# Altium schematic sheet BLOCK4.SchDoc
size A3; SheetNumber: 4; SheetTotal: 12
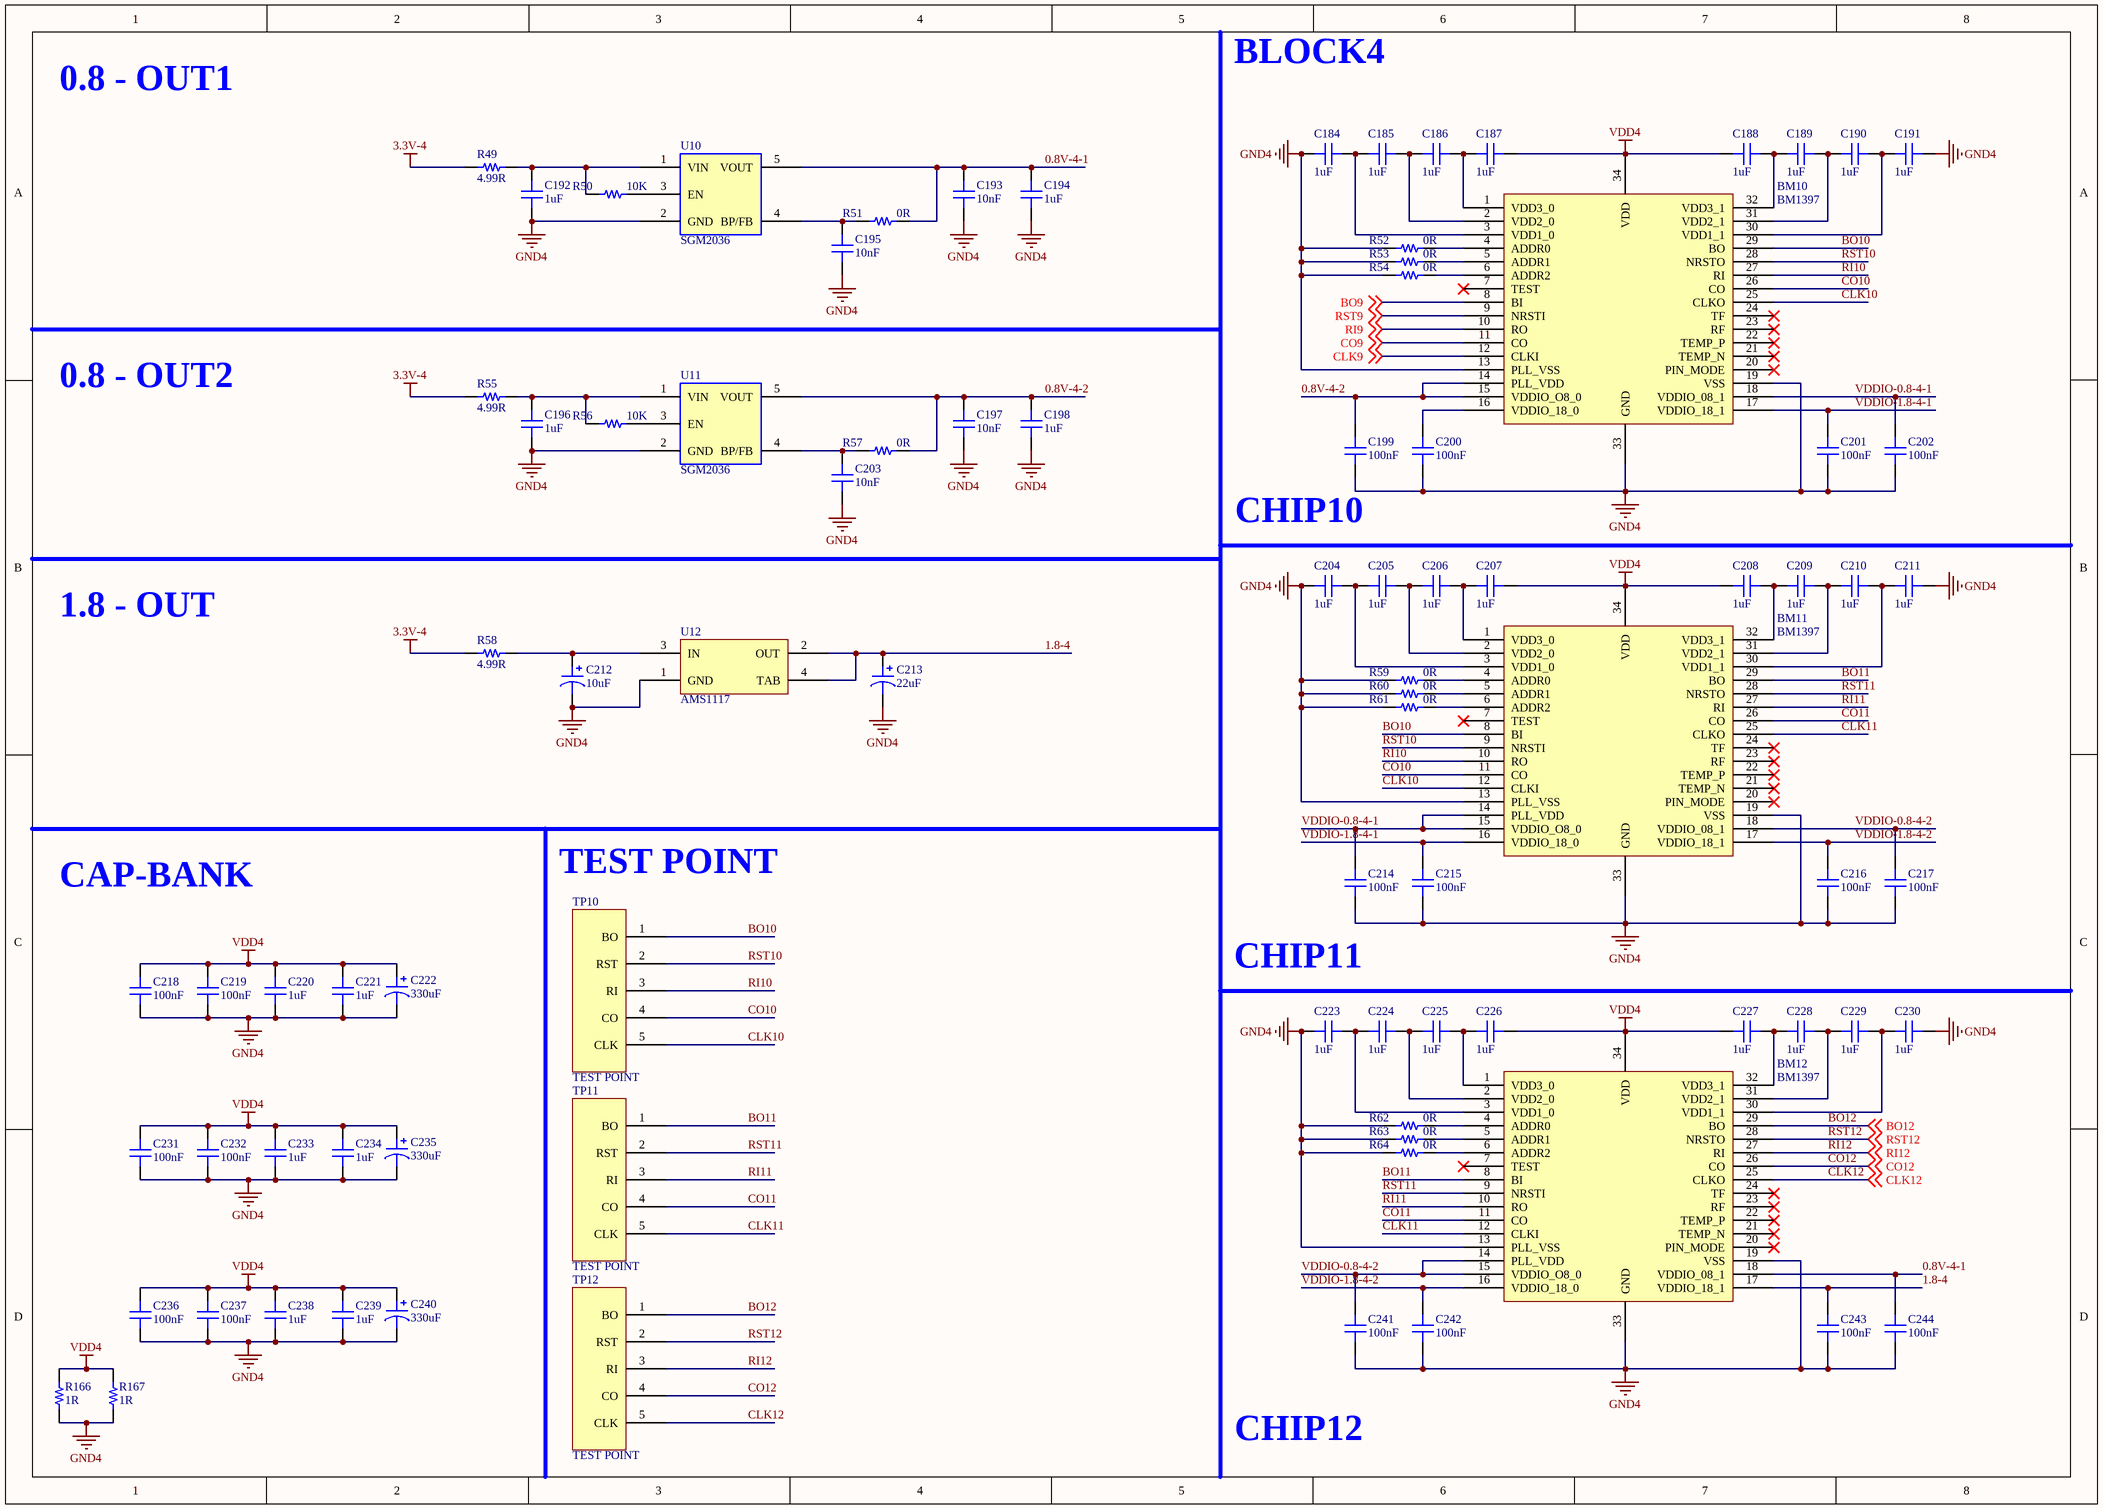
[diagram p0: BLOCK4.SchDoc]

## Parts
BM10  BM1397  [BM1387]
BM11  BM1397  [BM1387]
BM12  BM1397  [BM1387]
C184  1uF  [CAP-SMD-0603]
C185  1uF  [CAP-SMD-0603]
C186  1uF  [CAP-SMD-0603]
C187  1uF  [CAP-SMD-0603]
C188  1uF  [CAP-SMD-0603]
C189  1uF  [CAP-SMD-0603]
C190  1uF  [CAP-SMD-0603]
C191  1uF  [CAP-SMD-0603]
C192  1uF  [CAP_SMD_0805]
C193  10nF  [CAP_SMD_0805]
C194  1uF  [CAP_SMD_0805]
C195  10nF  [CAP_SMD_0805]
C196  1uF  [CAP_SMD_0805]
C197  10nF  [CAP_SMD_0805]
C198  1uF  [CAP_SMD_0805]
C199  100nF  [CAP_SMD_0805]
C200  100nF  [CAP_SMD_0805]
C201  100nF  [CAP_SMD_0805]
C202  100nF  [CAP_SMD_0805]
C203  10nF  [CAP_SMD_0805]
C204  1uF  [CAP-SMD-0603]
C205  1uF  [CAP-SMD-0603]
C206  1uF  [CAP-SMD-0603]
C207  1uF  [CAP-SMD-0603]
C208  1uF  [CAP-SMD-0603]
C209  1uF  [CAP-SMD-0603]
C210  1uF  [CAP-SMD-0603]
C211  1uF  [CAP-SMD-0603]
C212  10uF  [CAP-TAN-CASE-A]
C213  22uF  [CAP-TAN-CASE-A]
C214  100nF  [CAP_SMD_0805]
C215  100nF  [CAP_SMD_0805]
C216  100nF  [CAP_SMD_0805]
C217  100nF  [CAP_SMD_0805]
C218  100nF  [CAP_SMD_0805]
C219  100nF  [CAP_SMD_0805]
C220  1uF  [CAP_SMD_0805]
C221  1uF  [CAP_SMD_0805]
C222  330uF  [CAP-TAN-CASE-E]
C223  1uF  [CAP-SMD-0603]
C224  1uF  [CAP-SMD-0603]
C225  1uF  [CAP-SMD-0603]
C226  1uF  [CAP-SMD-0603]
C227  1uF  [CAP-SMD-0603]
C228  1uF  [CAP-SMD-0603]
C229  1uF  [CAP-SMD-0603]
C230  1uF  [CAP-SMD-0603]
C231  100nF  [CAP_SMD_0805]
C232  100nF  [CAP_SMD_0805]
C233  1uF  [CAP_SMD_0805]
C234  1uF  [CAP_SMD_0805]
C235  330uF  [CAP-TAN-CASE-E]
C236  100nF  [CAP_SMD_0805]
C237  100nF  [CAP_SMD_0805]
C238  1uF  [CAP_SMD_0805]
C239  1uF  [CAP_SMD_0805]
C240  330uF  [CAP-TAN-CASE-E]
C241  100nF  [CAP_SMD_0805]
C242  100nF  [CAP_SMD_0805]
C243  100nF  [CAP_SMD_0805]
C244  100nF  [CAP_SMD_0805]
R49  4.99R  [RES-SMD-1206]
R50  10K  [RES-SMD-0402]
R51  0R  [RES-SMD-0402]
R52  0R  [RES-SMD-0402]
R53  0R  [RES-SMD-0402]
R54  0R  [RES-SMD-0402]
R55  4.99R  [RES-SMD-1206]
R56  10K  [RES-SMD-0402]
R57  0R  [RES-SMD-0402]
R58  4.99R  [RES-SMD-1206]
R59  0R  [RES-SMD-0402]
R60  0R  [RES-SMD-0402]
R61  0R  [RES-SMD-0402]
R62  0R  [RES-SMD-0402]
R63  0R  [RES-SMD-0402]
R64  0R  [RES-SMD-0402]
R166  1R  [RES-SMD-1210]
R167  1R  [RES-SMD-1210]
TP10  TEST POINT  [TEST_POINT]
TP11  TEST POINT  [TEST_POINT]
TP12  TEST POINT  [TEST_POINT]
U10  SGM2036  [SOT23-5PIN]
U11  SGM2036  [SOT23-5PIN]
U12  AMS1117  [AMS1117]

## Nets
3.3V-4: R49.1 R55.1 R58.1
GND4: BM10.13(PLL_VSS) BM10.19(VSS) BM10.33(GND) BM11.13(PLL_VSS) BM11.19(VSS) BM11.33(GND) BM12.13(PLL_VSS) BM12.19(VSS) BM12.33(GND) C184.1 C191.2 C192.1 C193.1 C194.1 C195.1 C196.1 C197.1 C198.1 C199.1 C200.1 C201.1 C202.1 C203.1 C204.1 C211.2 C212.2 C213.2 C214.1 C215.1 C216.1 C217.1 C218.1 C219.1 C220.1 C221.1 C222.2 C223.1 C230.2 C231.1 C232.1 C233.1 C234.1 C235.2 C236.1 C237.1 C238.1 C239.1 C240.2 C241.1 C242.1 C243.1 C244.1 R52.1 R53.1 R54.1 R59.1 R60.1 R61.1 R62.1 R63.1 R64.1 R166.1 R167.1 U10.2(GND) U11.2(GND) U12.1(GND)
VDD4: BM10.34(VDD) BM11.34(VDD) BM12.34(VDD) C187.2 C188.1 C207.2 C208.1 C218.2 C219.2 C220.2 C221.2 C222.1 C226.2 C227.1 C231.2 C232.2 C233.2 C234.2 C235.1 C236.2 C237.2 C238.2 C239.2 C240.1 R166.2 R167.2
0.8V-4-1: BM12.18(VDDIO_08_1) C193.2 C194.2 C244.2 R51.2 U10.5(VOUT)
0.8V-4-2: BM10.14(PLL_VDD) BM10.15(VDDIO_O8_0) C197.2 C198.2 C199.2 R57.2 U11.5(VOUT)
1.8-4: BM12.17(VDDIO_18_1) C213.1 C243.2 U12.2(OUT) U12.4(TAB)
BO9: BM10.8(BI) ; off-sheet BO9
BO10: BM10.29(BO) BM11.8(BI) TP10.1(BO)
BO11: BM11.29(BO) BM12.8(BI) TP11.1(BO)
BO12: BM12.29(BO) TP12.1(BO) ; off-sheet BO12
CLK9: BM10.12(CLKI) ; off-sheet CLK9
CLK10: BM10.25(CLKO) BM11.12(CLKI) TP10.5(CLK)
CLK11: BM11.25(CLKO) BM12.12(CLKI) TP11.5(CLK)
CLK12: BM12.25(CLKO) TP12.5(CLK) ; off-sheet CLK12
CO9: BM10.11(CO) ; off-sheet CO9
CO10: BM10.26(CO) BM11.11(CO) TP10.4(CO)
CO11: BM11.26(CO) BM12.11(CO) TP11.4(CO)
CO12: BM12.26(CO) TP12.4(CO) ; off-sheet CO12
RI9: BM10.10(RO) ; off-sheet RI9
RI10: BM10.27(RI) BM11.10(RO) TP10.3(RI)
RI11: BM11.27(RI) BM12.10(RO) TP11.3(RI)
RI12: BM12.27(RI) TP12.3(RI) ; off-sheet RI12
RST9: BM10.9(NRSTI) ; off-sheet RST9
RST10: BM10.28(NRSTO) BM11.9(NRSTI) TP10.2(RST)
RST11: BM11.28(NRSTO) BM12.9(NRSTI) TP11.2(RST)
RST12: BM12.28(NRSTO) TP12.2(RST) ; off-sheet RST12
VDDIO-0.8-4-1: BM10.18(VDDIO_08_1) BM11.14(PLL_VDD) BM11.15(VDDIO_O8_0) C202.2 C214.2
VDDIO-0.8-4-2: BM11.18(VDDIO_08_1) BM12.14(PLL_VDD) BM12.15(VDDIO_O8_0) C217.2 C241.2
VDDIO-1.8-4-1: BM10.17(VDDIO_18_1) BM11.16(VDDIO_18_0) C201.2 C215.2
VDDIO-1.8-4-2: BM11.17(VDDIO_18_1) BM12.16(VDDIO_18_0) C216.2 C242.2
NetBM10_1: BM10.1(VDD3_0) C186.2 C187.1
NetBM10_2: BM10.2(VDD2_0) C185.2 C186.1
NetBM10_3: BM10.3(VDD1_0) C184.2 C185.1
NetBM10_4: BM10.4(ADDR0) R52.2
NetBM10_5: BM10.5(ADDR1) R53.2
NetBM10_6: BM10.6(ADDR2) R54.2
NetBM10_16: BM10.16(VDDIO_18_0) C200.2
NetBM10_30: BM10.30(VDD1_1) C190.2 C191.1
NetBM10_31: BM10.31(VDD2_1) C189.2 C190.1
NetBM10_32: BM10.32(VDD3_1) C188.2 C189.1
NetBM11_1: BM11.1(VDD3_0) C206.2 C207.1
NetBM11_2: BM11.2(VDD2_0) C205.2 C206.1
NetBM11_3: BM11.3(VDD1_0) C204.2 C205.1
NetBM11_4: BM11.4(ADDR0) R59.2
NetBM11_5: BM11.5(ADDR1) R60.2
NetBM11_6: BM11.6(ADDR2) R61.2
NetBM11_30: BM11.30(VDD1_1) C210.2 C211.1
NetBM11_31: BM11.31(VDD2_1) C209.2 C210.1
NetBM11_32: BM11.32(VDD3_1) C208.2 C209.1
NetBM12_1: BM12.1(VDD3_0) C225.2 C226.1
NetBM12_2: BM12.2(VDD2_0) C224.2 C225.1
NetBM12_3: BM12.3(VDD1_0) C223.2 C224.1
NetBM12_4: BM12.4(ADDR0) R62.2
NetBM12_5: BM12.5(ADDR1) R63.2
NetBM12_6: BM12.6(ADDR2) R64.2
NetBM12_30: BM12.30(VDD1_1) C229.2 C230.1
NetBM12_31: BM12.31(VDD2_1) C228.2 C229.1
NetBM12_32: BM12.32(VDD3_1) C227.2 C228.1
NetC192_2: C192.2 R49.2 R50.1 U10.1(VIN)
NetC195_2: C195.2 R51.1 U10.4(BP/FB)
NetC196_2: C196.2 R55.2 R56.1 U11.1(VIN)
NetC203_2: C203.2 R57.1 U11.4(BP/FB)
NetC212_1: C212.1 R58.2 U12.3(IN)
NetR50_2: R50.2 U10.3(EN)
NetR56_2: R56.2 U11.3(EN)

Not connected (* = marked no-connect by the designer): BM10 7(TEST)* 20(PIN_MODE)* 21(TEMP_N)* 22(TEMP_P)* 23(RF)* 24(TF)*; BM11 7(TEST)* 20(PIN_MODE)* 21(TEMP_N)* 22(TEMP_P)* 23(RF)* 24(TF)*; BM12 7(TEST)* 20(PIN_MODE)* 21(TEMP_N)* 22(TEMP_P)* 23(RF)* 24(TF)*

## Notes on the sheet
- 0.8 - OUT1
- BLOCK4
- 0.8 - OUT2
- (near C199) CHIP10
- 1.8 - OUT
- CAP-BANK
- TEST POINT
- CHIP11
- CHIP12

## Library data of the parts
BM10-BM12 = BM1397_1
C184-C211 C214-C221 C223-C234 C236-C239 C241-C244 = CAP
C212 C213 C222 C235 C240 = POLARIZED CAP
R49-R64 R166 R167 = RES